# EAGLE design DigiMult_01 (EAGLE 9.4.0)
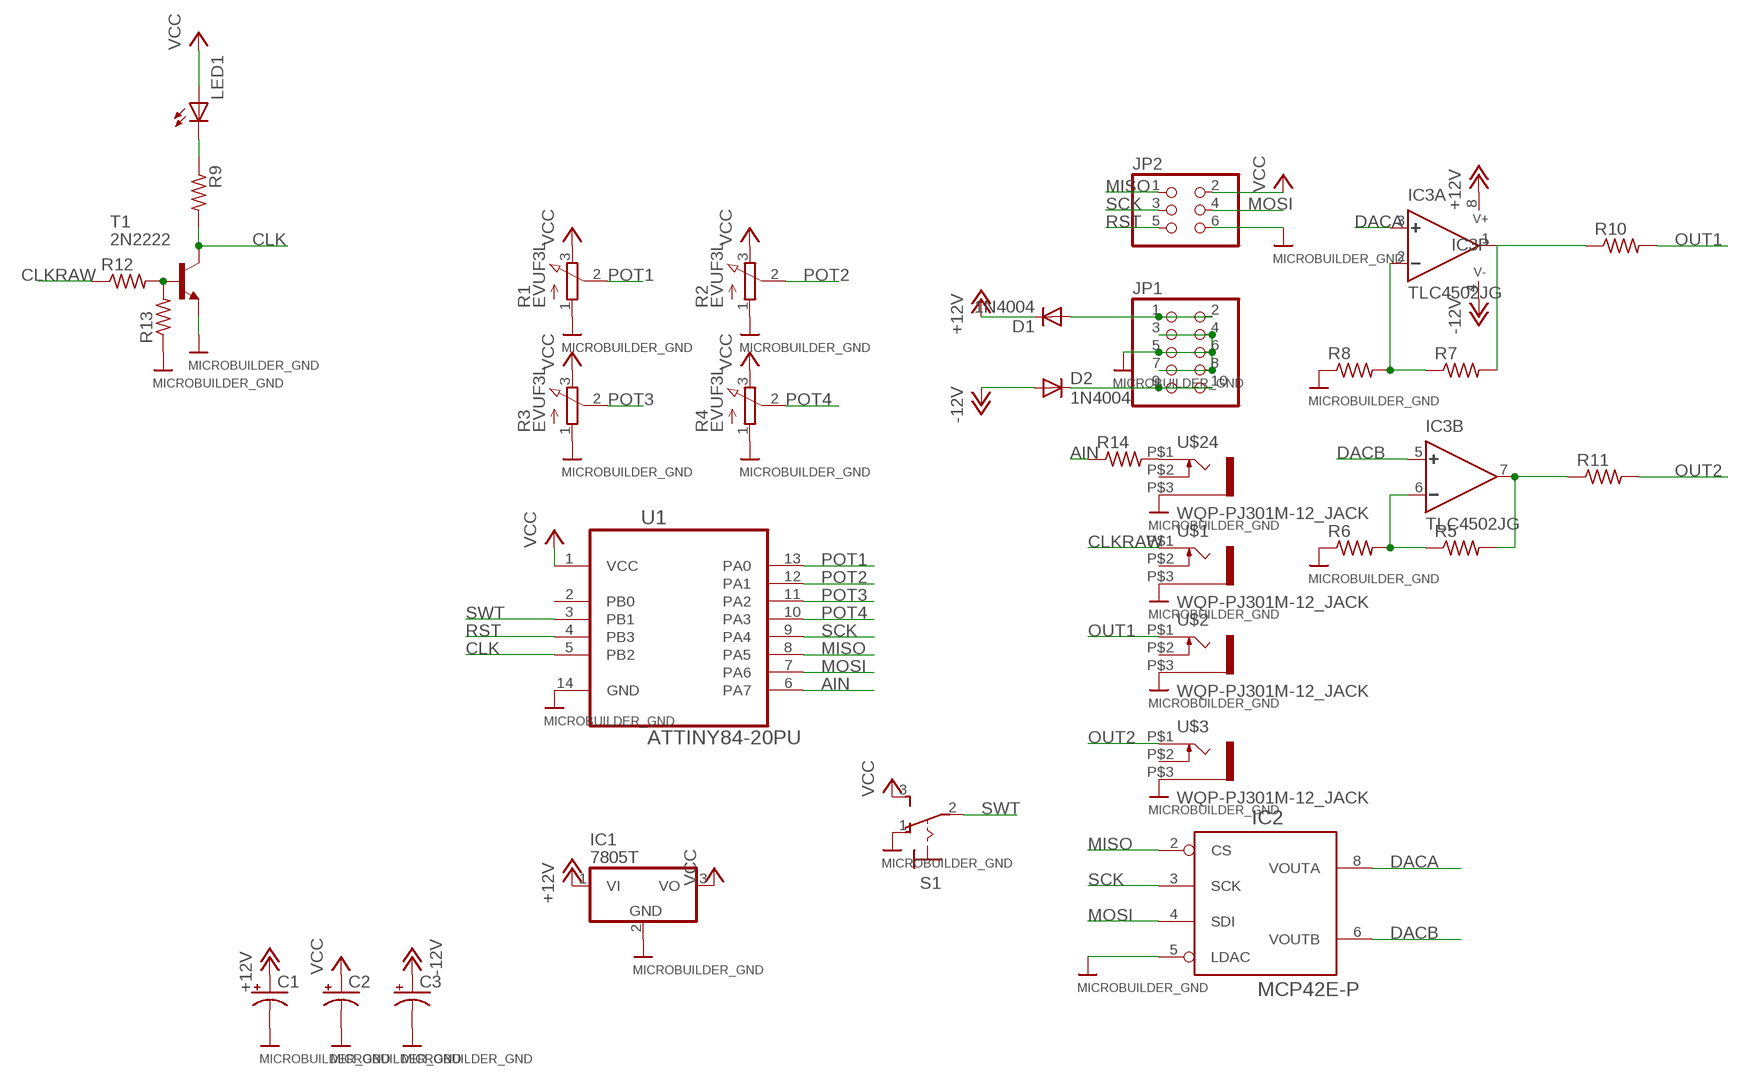
[diagram p0: schematic, sheet 1]

## Parts
C1  CPOL-USE2.5-5  [E2,5-5]
C2  CPOL-USE2.5-5  [E2,5-5]
C3  CPOL-USE2.5-5  [E2,5-5]
D1  1N4004  [DO41-10]
D2  1N4004  [DO41-10]
IC1  7805T  [TO220H]
IC2  MCP42E-P  [DIL08]
IC3  TLC4502JG  [DIL08]
JP1  PINHD-2X5/OCT  [2X05]
JP2  PINHD-2X3/OCT  [2X03]
LED1  LED3MM  [LED3MM]
R1  EVUF3L  [EVUFXL]
R2  EVUF3L  [EVUFXL]
R3  EVUF3L  [EVUFXL]
R4  EVUF3L  [EVUFXL]
R5  R-US_0204/2V  [0204V]
R6  R-US_0204/2V  [0204V]
R7  R-US_0204/2V  [0204V]
R8  R-US_0204/2V  [0204V]
R9  R-US_0204/2V  [0204V]
R10  R-US_0204/2V  [0204V]
R11  R-US_0204/2V  [0204V]
R12  R-US_0204/2V  [0204V]
R13  R-US_0204/2V  [0204V]
R14  R-US_0204/2V  [0204V]
S1  M9040P  [M9040P]
T1  2N2222  [TO92-EBC-OVAL]
U1  ATTINY84-20PU  [DIP254P762X533-14]
U$1  WQP-PJ301M-12_JACK  [WQP-PJ301M-12_JACK]
U$2  WQP-PJ301M-12_JACK  [WQP-PJ301M-12_JACK]
U$3  WQP-PJ301M-12_JACK  [WQP-PJ301M-12_JACK]
U$24  WQP-PJ301M-12_JACK  [WQP-PJ301M-12_JACK]

## Nets
+12V: C1.+ D1.C IC1.1(VI) IC3.8(P:V+)
-12V: C3.+ D2.A IC3.4(P:V-)
AIN: R14.1 U1.6(PA7)
CLK: R9.2 T1.C U1.5(PB2)
CLKRAW: R12.1 U$1.P$1
DACA: IC2.8(VOUTA) IC3.3(A:+)
DACB: IC2.6(VOUTB) IC3.5(B:+)
GND: C1.- C2.- C3.- IC1.2(GND) IC2.5(LDAC) JP1.3 JP1.4 JP1.5 JP1.6 JP1.7 JP1.8 JP2.6 R1.1(A) R2.1(A) R3.1(A) R4.1(A) R6.1 R8.1 R13.1 S1.1(O) T1.E U1.14(GND) U$1.P$3 U$2.P$3 U$3.P$3 U$24.P$3 ; supply symbol labelled MICROBUILDER_GND
MISO: IC2.2(CS) JP2.1 U1.8(PA5)
MOSI: IC2.4(SDI) JP2.4 U1.7(PA6)
N$1: LED1.K(C) R9.1
N$2: IC3.7(B:OUT) R5.2 R11.1
N$3: IC3.1(A:OUT) R7.2 R10.1
N$4: R12.2 R13.2 T1.B
N$5: D1.A JP1.1 JP1.2
N$6: IC3.2(A:-) R7.1 R8.2
N$7: IC3.6(B:-) R5.1 R6.2
N$8: D2.C JP1.9 JP1.10
N$9: R14.2 U$24.P$1
OUT1: R10.2 U$2.P$1
OUT2: R11.2 U$3.P$1
POT1: R1.2(S) U1.13(PA0)
POT2: R2.2(S) U1.12(PA1)
POT3: R3.2(S) U1.11(PA2)
POT4: R4.2(S) U1.10(PA3)
RST: JP2.5 U1.4(PB3)
SCK: IC2.3(SCK) JP2.3 U1.9(PA4)
SWT: S1.2(P) U1.3(PB1)
VCC: C2.+ IC1.3(VO) JP2.2 LED1.A R1.3(E) R2.3(E) R3.3(E) R4.3(E) S1.3(S) U1.1(VCC)
Unconnected: U1.2(PB0) U$1.P$2 U$2.P$2 U$3.P$2 U$24.P$2

## Power pins joined to a net without a drawn wire
GND: IC2.7(GND)
VCC: IC2.1(VCC)

## Library data of the parts
C1-C3 = adafruit:CPOL-US: POLARIZED CAPACITOR, American symbol
D1 D2 = adafruit:1N4004: DIODE General purpose 1N400x type rectifier (With bigger pads) http://www.ladyada.net/library/pcb/eaglelibrary.html
IC1 = adafruit:78*: Positive VOLTAGE REGULATOR Added bigger pads to the TO-92 package
IC2 = dac:MCP4*2: DAC 8BIT DUAL SPI/VREF
IC3 = texas:TLC4502: FAMILY OF SELF-CALIBRATING (Self-Cal TM) PRECISION CMOS RAIL-TO-RAIL OUTPUT OPERATIONAL AMPLIFIERS Source: Data sheet <http://www.ti.com/lit/ds/symlink/tlc4502.pdf>
JP1 = pinhead_v2:PINHD-2X5: PIN HEADER
JP2 = pinhead_v2:PINHD-2X3: PIN HEADER
LED1 = adafruit:LED: LED OSRAM: - CHIPLED LG R971, LG N971, LY N971, LG Q971, LY Q971, LO R971, LY R971 LH N974, LH R974 LS Q976, LO Q976, LY Q976 LO Q996 - Hyper CHIPLED LW Q18S LB Q993, LB Q99A, LB R99A - SideLED LS A670, LO A670, LY A670, LG A670, LP A670 LB A673, LV A673, LT A673, LW A673 LH A674 LY A675 LS A676, LA A676, LO A676, LY A676, LW A676 LS A679, LY A679, LG A679 - Hyper Micro SIDELED® LS Y876, LA Y876, LO Y876, LY Y876 LT Y87S - SmartLED LW L88C, LW L88S LB L89C, LB L89S, LG L890 LS L89K, LO L89K, LY L89K LS L896, LA L896, LO L896, LY L896 - TOPLED LS T670, LO T670, LY T670, LG T670, LP T670 LSG T670, LSP T670, LSY T670, LOP T670, LYG T670 LG T671, LOG T671, LSG T671 LB T673, LV T673, LT T673, LW T673 LH T674 LS T676, LA T676, LO T676, LY T676, LB T676, LH T676, LSB T676, LW T676 LB T67C, LV T67C, LT T67C, LS T67K, LO T67K, LY T67K, LW E67C LS E67B, LA E67B, LO E67B, LY E67B, LB E67C, LV E67C, LT E67C LW T67C LS T679, LY T679, LG T679 LS T770, LO T770, LY T770, LG T770, LP T770 LB T773, LV T773, LT T773, LW T773 LH T774 LS E675, LA E675, LY E675, LS T675 LS T776, LA T776, LO T776, LY T776, LB T776 LHGB T686 LT T68C, LB T68C - Hyper Mini TOPLED® LB M676 - Mini TOPLED Santana® LG M470 LS M47K, LO M47K, LY M47K Source: http://www.osram.convergy.de/
R1-R4 = pot:EVU: 9 mm Square Rotary Potentiometers Source: Panasonic
R5-R14 = adafruit:R-US_: RESISTOR, American symbol
S1 = switch:M9040P: TOGGLE SWITCH Marquardt
T1 = adafruit:2N2222: NPN TRANSISTOR Big oval pads
U1 = Atmel_By_element14_Batch_1-00:ATTINY84-20PU: 8-bit Microcontroller with In-System Programmable Flash; MPN: ATTINY84-20PU; OC_FARNELL: -; OC_NEWARK: 58M3794; PACKAGE: PDIP-14; SUPPLIER: Atmel
U$1-U$3 U$24 = thonkiconn:WQP-PJ301M-12_JACK

## Board
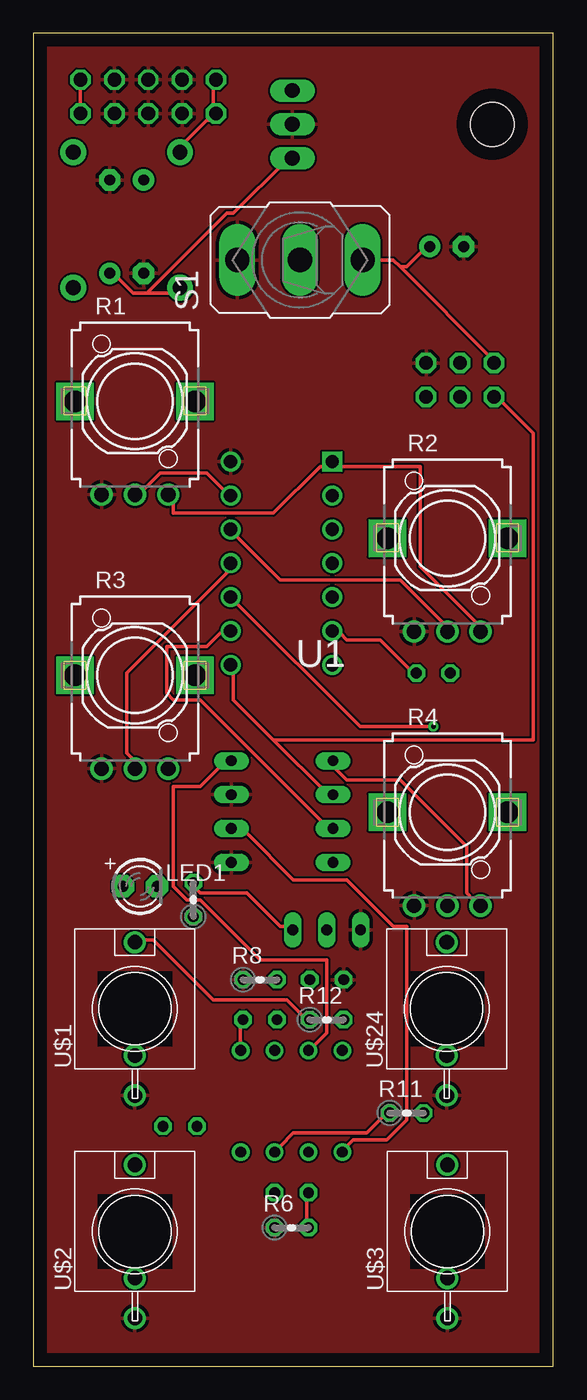
[diagram p1: board, top side]
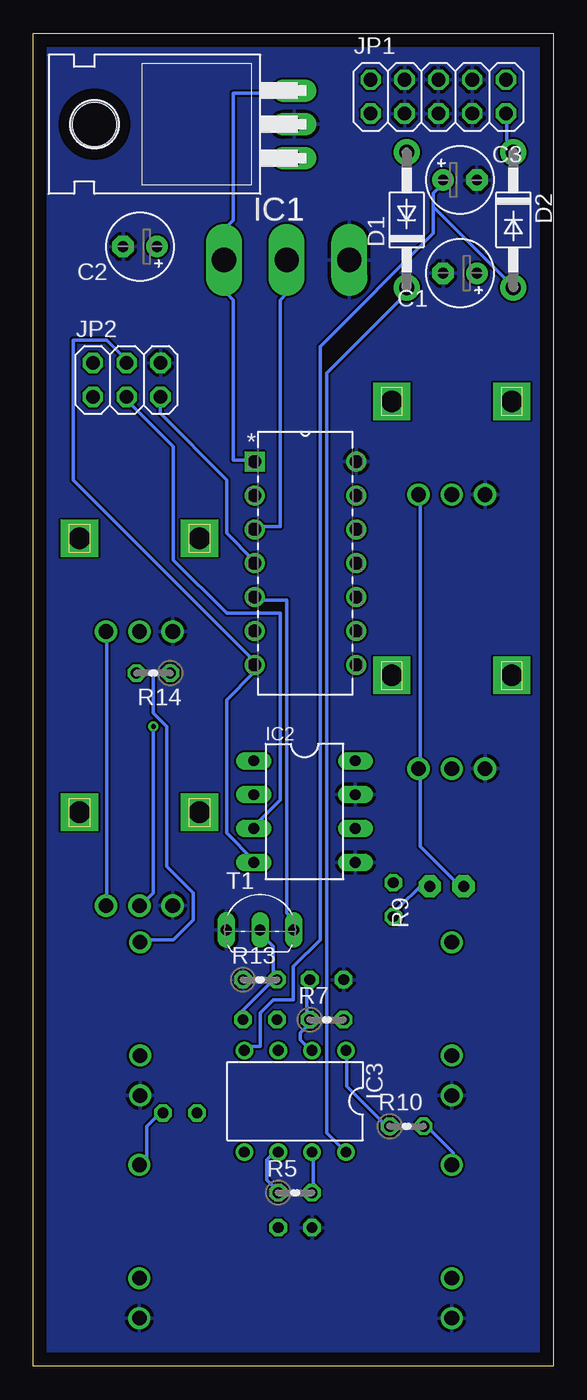
[diagram p2: board, bottom side, seen from below]

Size 39 x 100 mm. Coordinates in mm from the lower left corner, seen from the top.
Outline: 0,0 39,0 39,100 0,100 0,0
Copper layers (1*16): Top 0.035mm / dielectric 1.5mm / Bottom 0.035mm
Design rules "default *": minimum track width 10mil, minimum drill 0.35mm, track to track 6mil, track to pad 6mil, pad to pad 6mil, via to via 6mil, smd to smd 6mil, copper to edge 40mil, drill to drill 6mil, minimum pad ring 10mil, minimum via ring 8mil, stop-mask expansion 4mil, vias tented up to drill 0mil, thermal gap 10mil

### Footprints (pad centres in the part's own frame; a part is rotated, then mirrored left to right if it is on the bottom)
E2,5-5 = drill 0.813 pad 1.6: + -1.27,0 | drill 0.813 pad 1.6 octagon: - 1.27,0
DO41-10 = drill 1.118 pad 1.93: A 5.08,0; C -5.08,0
TO220H = drill 1.118 long: 1 -2.54,-10.16; 2 0,-10.16; 3 2.54,-10.16 | hole 3.302: 0,4.826
DIL08 = drill 0.813 long: 1 -3.81,-3.81; 2 -1.27,-3.81; 3 1.27,-3.81; 4 3.81,-3.81; 5 3.81,3.81; 6 1.27,3.81; 7 -1.27,3.81; 8 -3.81,3.81
DIL08' = drill 0.813 pad 1.27: 1 -3.81,-3.81; 2 -1.27,-3.81; 3 1.27,-3.81; 4 3.81,-3.81; 5 3.81,3.81; 6 1.27,3.81; 7 -1.27,3.81; 8 -3.81,3.81
2X05 = drill 1.016 octagon: 1 -5.08,-1.27; 2 -5.08,1.27; 3 -2.54,-1.27; 4 -2.54,1.27; 5 0,-1.27; 6 0,1.27; 7 2.54,-1.27; 8 2.54,1.27; 9 5.08,-1.27; 10 5.08,1.27
2X03 = drill 1.016 octagon: 1 -2.54,-1.27; 2 -2.54,1.27; 3 0,-1.27; 4 0,1.27; 5 2.54,-1.27; 6 2.54,1.27
LED3MM = drill 0.813 pad 1.676 octagon: A -1.27,0; K 1.27,0
EVUFXL = drill 1.1 pad 1.676: 1 -2.5,-7; 2 0,-7; 3 2.5,-7 | drill 1.6 pad 2.8 square: M1 4.5,0; M2 -4.5,0
0204V = drill 0.813 octagon: 1 -1.27,0; 2 1.27,0
M9040P = drill 1.803 long: 1 0,4.699; 2 0,0; 3 0,-4.699
TO92-EBC-OVAL = drill 0.813 long: B 0,-1.27; C 2.54,-1.27; E -2.54,-1.27
DIP254P762X533-14 = drill 0.991 square: 1 -7.62,15.24 | drill 0.991: 2 -7.62,12.7; 3 -7.62,10.16; 4 -7.62,7.62; 5 -7.62,5.08; 6 -7.62,2.54; 7 -7.62,0; 8 0,0; 9 0,2.54; 10 0,5.08; 11 0,7.62; 12 0,10.16; 13 0,12.7; 14 0,15.24
WQP-PJ301M-12_JACK = drill 1.1: P$1 0,5; P$2 0,-3.5; P$3 0,-6.5

### Placement (x,y rotation side)
C1  7,82 180 bottom
C2  31,84 180 bottom
C3  7,89 0 bottom
D1  11,86 90 bottom
D2  3,86 270 bottom
IC1  29.59,93.17 90 bottom
IC2  18.66,41.61 270 bottom
IC3  TLC4502JG  [DIL08']  19.36,19.87 180 bottom
JP1  8.62,95.25 0 bottom
JP2  32,74 0 bottom
LED1  8,36 0 top
R1  7.62,72.39 0 top
R2  31.05,62.11 0 top
R3  7.62,51.84 0 top
R4  31.05,41.56 0 top
R5  19.36,13.02 0 bottom
R6  19.36,10.4 0 top
R7  17,26 0 bottom
R8  17,29 0 top
R9  12,35 90 top
R10  11,18 0 bottom
R11  28,19 0 top
R12  22,26 0 top
R13  22,29 0 bottom
R14  30,52 180 bottom
S1  20,83 90 top
T1  22,34 0 bottom
U1  14.79,52.62 0 bottom
U$1  7.62,26.81 0 top
U$2  7.62,10.11 0 top
U$3  31.05,10.11 0 top
U$24  31,26.81 0 top

### Tracks (layer width: path | path; a pad name or v marks a point on that pad's centre or on a via)
+12V
  Top 0.254: 8.5,80.5 11,80.5 D1.C | 8.5,80.5 7.5,80.5 6,82 C1.+ | 8.5,80.5 14.5,86.5 15,86.5 19,90.5 IC1.1
  Bottom 0.254: IC3.8 16,16.5 17,17.5 17,74.5 11,80.5 D1.C
-12V
  Bottom 0.254: 9,87 9,88 8.5,88.5 8.5,89 C3.+ | 9,87 9,85 17.5,76.5 17.5,32 19.5,30 19.5,27.5 21,27.5 22,26.5 22,24 23,24 IC3.4 | 9,87 3,81 D2.A
AIN
  Top 0.254: R14.1 28.5,52 26,54.5 23.5,54.5 23,55 22.5,55 U1.6
CLK
  Top 0.254: R9.2 12,36 12.5,35.5 16,35.5 18.5,33 19,33 T1.C
  Bottom 0.254: U1.5 22,57.5 20,57.5 20,34 19.5,33.5 19.5,33 T1.C
CLKRAW
  Top 0.254: R12.1 20.5,26 19,27.5 13.5,27.5 9,32 8,32 U$1.P$1
DACA
  Top 0.254: IC3.3 21,24 22,25 22,30.5 17,30.5 12.5,35 11.5,35 10.5,36 10.5,43.5 12.5,43.5 14,45 14.5,45 IC2.8
DACB
  Top 0.254: IC3.5 23.5,16.5 24,17 26.5,17 28,18.5 28,33 27,33 23.5,36.5 19.5,36.5 16,40 15,40 IC2.6
GND
  pour Top: 0,100 0,0 39,0 39,100
  pour Bottom: 0,100 0,0 39,0 39,100
MISO
  Top 0.254: 18,47 15,50 15,52.5 U1.8 | 18,47 22,43 IC2.2 | 18,47 37.5,47 37.5,70 35,72.5 JP2.1
MOSI
  Bottom 0.254: IC2.4 22.5,38 24.5,40 24.5,50 22.5,52 22.5,52.5 U1.7 22.5,53 36,66.5 36,77 33.5,77 32,75.5 JP2.4
N$1
  Bottom 0.254: R9.1 12,34 9.5,36.5 9,36.5 9,36 LED1.K
N$2
  Top 0.254: R11.1 26.5,19 25,17.5 19.5,17.5 18.5,16.5 IC3.7
  Bottom 0.254: R5.2 18,13.5 18,16 IC3.7
N$3
  Top 0.254: R7.2 15.5,26 15.5,24 IC3.1
  Bottom 0.254: R10.1 12.5,18 15.5,21 15.5,23.5 IC3.1
N$4
  Bottom 0.254: 21,29 23.5,26.5 23.5,26 R12.2 | 21,29 21,31.5 22,32.5 T1.B | 21,29 R13.2
N$5
  Top 0.254: JP1.2 13.5,96.5 13.5,94 JP1.1 13.5,93.5 13,93.5 11,91.5 D1.A
N$6
  Bottom 0.254: 18.5,26 18.5,25.5 19,25 19,24.5 18.5,24 IC3.2 | 18.5,26 18.5,29 R8.2 | 18.5,26 R7.1
N$7
  Top 0.254: R6.2 20.5,10.5 20.5,13 R5.1
  Bottom 0.254: IC3.6 21,16 21.5,15.5 21.5,14 21,13.5 R5.1
N$8
  Top 0.254: JP1.9 3.5,94 3.5,96.5 JP1.10
  Bottom 0.254: D2.C 3,91.5 3.5,92 3.5,93.5 JP1.9
N$9
  Bottom 0.254: R14.2 30,52 30,49 29,48 29,37.5 27,35.5 27,33.5 28.5,32 31,32 U$24.P$1
OUT1
  Bottom 0.254: R10.2 9.5,18 7.5,16 7.5,15.5 U$2.P$1
OUT2
  Bottom 0.254: R11.2 29.5,19 30.5,18 30.5,15.5 31,15 U$3.P$1
POT1
  Top 0.254: U1.13 14.5,65.5 13,67 9.5,67 8,65.5 R1.2
POT2
  Top 0.254: U1.12 15,62.5 18.5,59 27.5,59 31,55.5 R2.2
POT3
  Top 0.254: U1.11 14.5,60 14.5,59.5 7,52 7,46 8,45 R3.2
POT4  (via drill 0.35)
  Top 0.254: v30,48 24.5,48 15,57.5 U1.10
  Bottom 0.254: v30,48 30,35.5 31,34.5 R4.2
RST
  Bottom 0.254: U1.4 22.5,60.5 24.5,62.5 24.5,66.5 29.5,71.5 29.5,72.5 JP2.5
SCK
  Top 0.254: IC2.3 22,40.5 12.5,50 10.5,50 10,50.5 10,54 13,54 14,55 14.5,55 U1.9
  Bottom 0.254: JP2.3 32,72.5 28.5,69 28.5,60.5 24.5,56.5 20.5,56.5 20.5,42.5 22,41 22,40.5 IC2.3
SWT
  Bottom 0.254: S1.2 20,80.5 20.5,80 20.5,63 22,63 U1.3
VCC
  Top 0.254: IC2.1 22.5,45 23.5,44 27.5,44 32.5,39 32.5,35.5 33,35 33.5,35 R4.3 | 27.5,82.5 27,83 S1.3 | 27.5,82.5 34.5,75.5 JP2.2 | 27.5,82.5 28,82.5 29.5,84 C2.+ | R2.3 33.5,55.5 29,60 29,67.5 22.5,67.5 U1.1 22,67.5 21.5,67.5 18,64 10.5,64 10.5,65 R1.3
  Bottom 0.254: LED1.A 7,36 10,39 10,44.5 R3.3 10,45 10,65 R1.3 | 24.5,83 24.5,80.5 24,80 24,68 22.5,68 U1.1 | 24.5,83 24.5,85.5 24,86 24,95.5 19.5,95.5 IC1.3 | 24.5,83 S1.3 | R4.3 33.5,35 33.5,55 R2.3